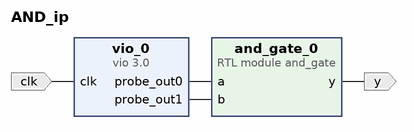
[diagram p0: block diagram of the top level]
# Vivado block design AND_ip, xc7s50csga324-1, Vivado 2025.2
create_bd_design AND_ip

create_bd_port -dir O y
create_bd_port -dir I -type clk clk

create_bd_cell -type ip -vlnv xilinx.com:ip:vio:3.0 vio_0
set_property -dict {CONFIG.C_NUM_PROBE_IN 0 CONFIG.C_NUM_PROBE_OUT 2} [get_bd_cells vio_0]
create_bd_cell -type module -reference and_gate and_gate_0

# ---- connections ----

connect_bd_net [get_bd_pins and_gate_0/y] [get_bd_ports y]
connect_bd_net -net clk_0_1 [get_bd_ports clk] [get_bd_pins vio_0/clk]
connect_bd_net [get_bd_pins vio_0/probe_out0] [get_bd_pins and_gate_0/a]
connect_bd_net [get_bd_pins vio_0/probe_out1] [get_bd_pins and_gate_0/b]

validate_bd_design
save_bd_design
